# EAGLE design BenchPower (EAGLE 7.4.0)
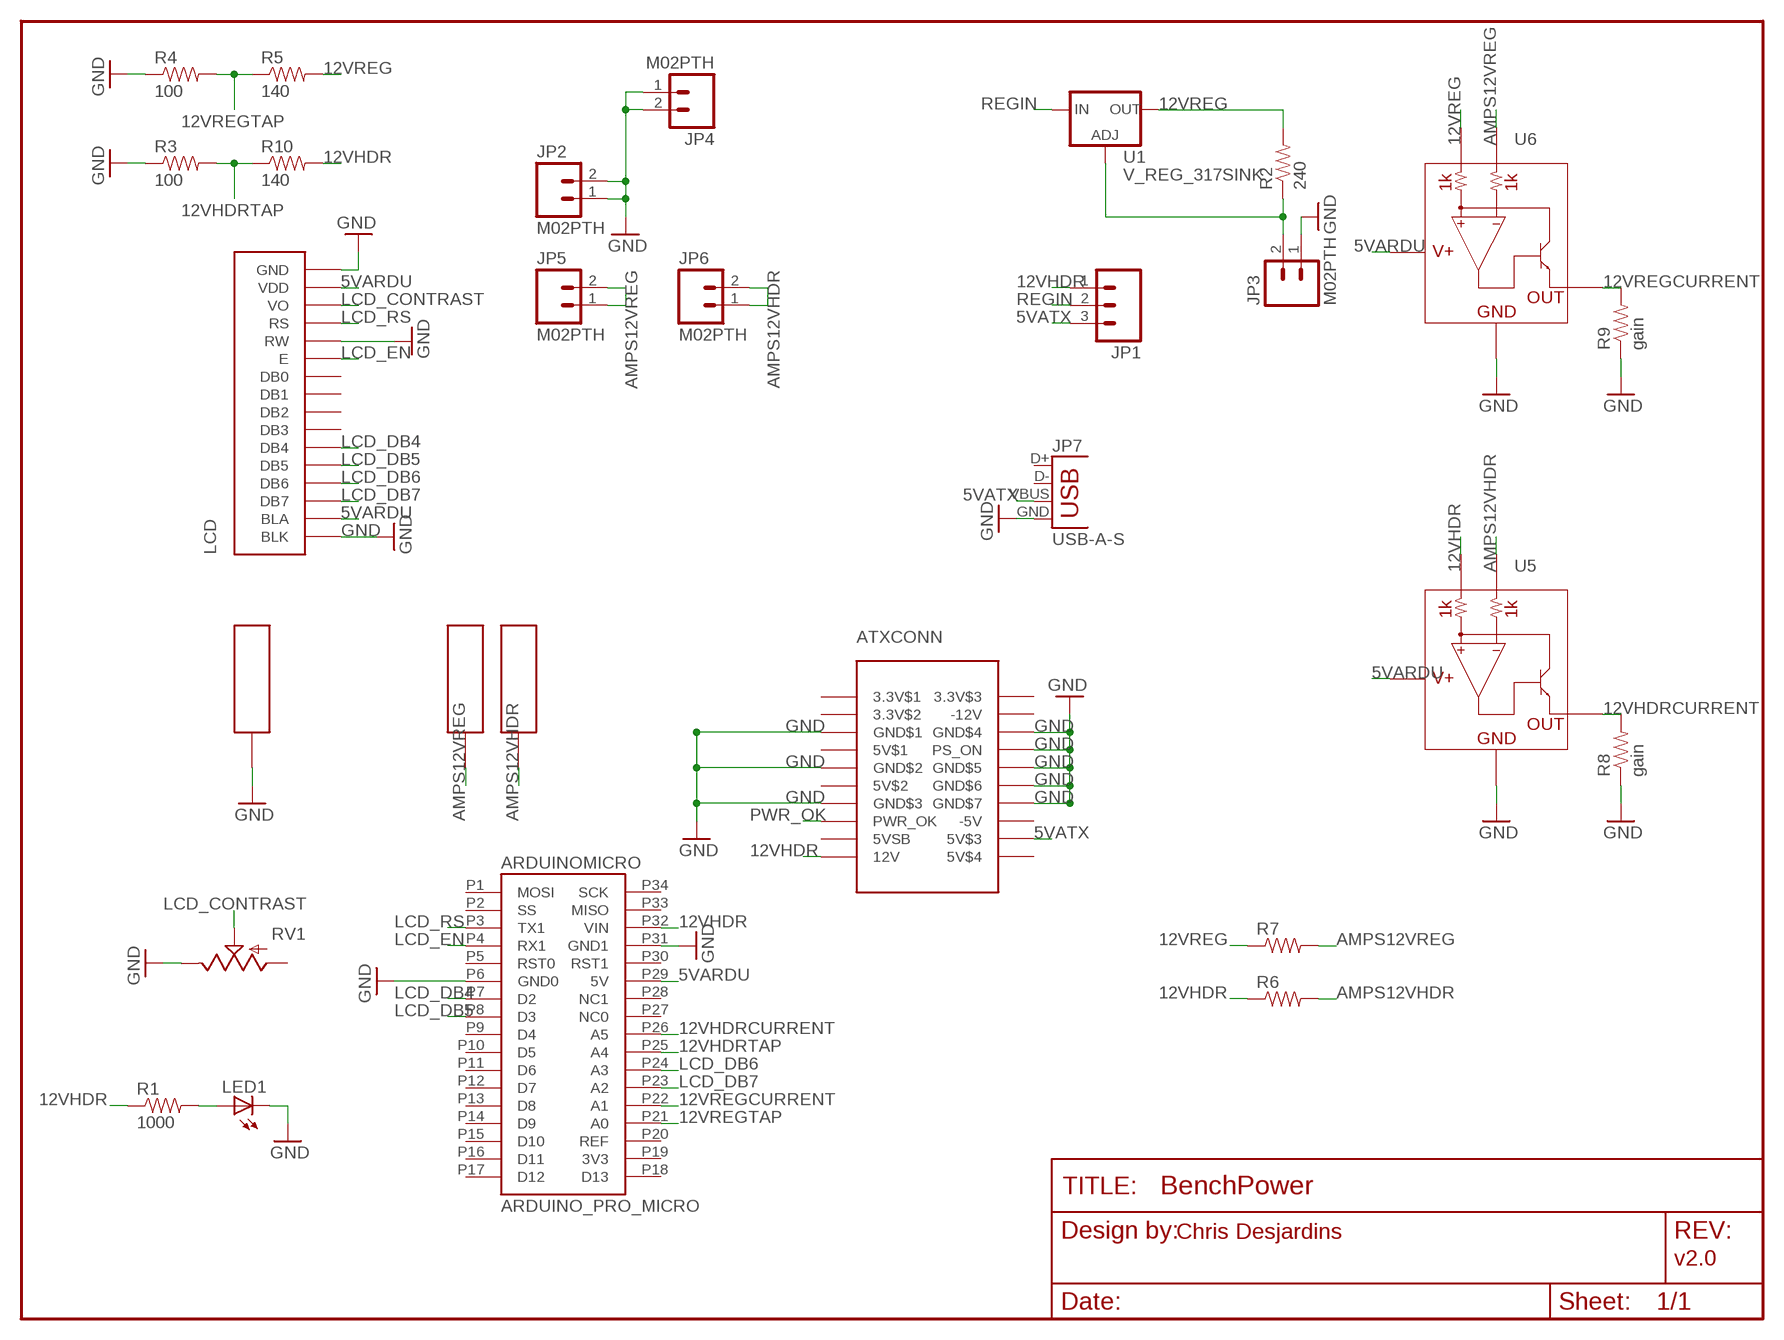
[diagram p0: schematic, sheet 1]

## Parts
ARDUINOMICRO  ARDUINO_PRO_MICRO  [ARDUINO_PRO_MICRO]
ATXCONN  ATXPOWER  [ATXPOWER]
JP1  M03PTH  [1X03]
JP2  M02PTH  [1X02]
JP3  M02PTH  [1X02]
JP4  M02PTH  [1X02]
JP5  M02PTH  [1X02]
JP6  M02PTH  [1X02]
JP7  USB-A-S  [USB-A-S]
LCD  16X2LCDDT162C  [DT162C]
LED1  LED3MM  [LED3MM]
PWR1  BINDINGPOST  [BINDINGPOST]
PWR2  BINDINGPOST  [BINDINGPOST]
R1  1000  RESISTORAXIAL-0.3  [AXIAL-0.3]
R2  240  RESISTORAXIAL-0.3  [AXIAL-0.3]
R3  100  RESISTORAXIAL-0.3  [AXIAL-0.3]
R4  100  RESISTORAXIAL-0.3  [AXIAL-0.3]
R5  140  RESISTORAXIAL-0.3  [AXIAL-0.3]
R6  RESISTOR1206  [1206]
R7  RESISTOR1206  [1206]
R8  gain  RESISTORAXIAL-0.3  [AXIAL-0.3]
R9  gain  RESISTORAXIAL-0.3  [AXIAL-0.3]
R10  140  RESISTORAXIAL-0.3  [AXIAL-0.3]
RV1  POT3266  [3266W]
U1  V_REG_317SINK  [TO220-ADJ]
U5  INA139  [SOT23-5]
U6  INA139  [SOT23-5]
U$5  BINDINGPOST  [BINDINGPOST]

## Nets
5VARDU: ARDUINOMICRO.P29(5V) LCD.P$2(VDD) LCD.P$15(BLA) U5.5(V+) U6.5(V+)
5VATX: ATXCONN.P$19(5V$3) JP1.3 JP7.VBUS
12VHDR: ARDUINOMICRO.P32(VIN) ATXCONN.P$10(12V) JP1.1 R1.P$1 R6.1 R10.P$2 U5.3(VIN+)
12VHDRCURRENT: ARDUINOMICRO.P26(A5) R8.P$2 U5.1(OUT)
12VHDRTAP: ARDUINOMICRO.P25(A4) R3.P$2 R10.P$1
12VREG: R2.P$2 R5.P$2 R7.1 U1.OUT U6.3(VIN+)
12VREGCURRENT: ARDUINOMICRO.P22(A1) R9.P$2 U6.1(OUT)
12VREGTAP: ARDUINOMICRO.P21(A0) R4.P$2 R5.P$1
ADJREG1: JP3.2 R2.P$1 U1.ADJ
AMPS12VHDR: JP6.1 JP6.2 PWR2.P$1 R6.2 U5.4(VIN-)
AMPS12VREG: JP5.1 JP5.2 PWR1.P$1 R7.2 U6.4(VIN-)
GND: ARDUINOMICRO.P6(GND0) ARDUINOMICRO.P31(GND1) ATXCONN.P$3(GND$1) ATXCONN.P$5(GND$2) ATXCONN.P$7(GND$3) ATXCONN.P$13(GND$4) ATXCONN.P$14(PS_ON) ATXCONN.P$15(GND$5) ATXCONN.P$16(GND$6) ATXCONN.P$17(GND$7) JP2.1 JP2.2 JP3.1 JP4.1 JP4.2 JP7.GND LCD.P$1(GND) LCD.P$5(RW) LCD.P$16(BLK) LED1.K(C) R3.P$1 R4.P$1 R8.P$1 R9.P$1 RV1.P$1(E) U5.2(GND) U6.2(GND) U$5.P$1
LCD_CONTRAST: LCD.P$3(VO) RV1.P$2(S)
LCD_DB4: ARDUINOMICRO.P7(D2) LCD.P$11(DB4)
LCD_DB5: ARDUINOMICRO.P8(D3) LCD.P$12(DB5)
LCD_DB6: ARDUINOMICRO.P24(A3) LCD.P$13(DB6)
LCD_DB7: ARDUINOMICRO.P23(A2) LCD.P$14(DB7)
LCD_EN: ARDUINOMICRO.P4(RX1) LCD.P$6(E)
LCD_RS: ARDUINOMICRO.P3(TX1) LCD.P$4(RS)
N$1: LED1.A R1.P$2
PWR_OK: ATXCONN.P$8(PWR_OK)
REGIN: JP1.2 U1.IN
Unconnected: ARDUINOMICRO.P1(MOSI) ARDUINOMICRO.P2(SS) ARDUINOMICRO.P5(RST0) ARDUINOMICRO.P9(D4) ARDUINOMICRO.P10(D5) ARDUINOMICRO.P11(D6) ARDUINOMICRO.P12(D7) ARDUINOMICRO.P13(D8) ARDUINOMICRO.P14(D9) ARDUINOMICRO.P15(D10) ARDUINOMICRO.P16(D11) ARDUINOMICRO.P17(D12) ARDUINOMICRO.P18(D13) ARDUINOMICRO.P27(NC0) ARDUINOMICRO.P28(NC1) ARDUINOMICRO.P30(RST1) ARDUINOMICRO.P33(MISO) ARDUINOMICRO.P34(SCK) JP7.D+ JP7.D- LCD.P$7(DB0) LCD.P$8(DB1) LCD.P$9(DB2) LCD.P$10(DB3) RV1.P$3(A)

## Notes on the sheet
- Chris Desjardins
- v2.0

## Power pins joined to a net without a drawn wire
3.3V$1: ATXCONN.P$1(3.3V$1)
3.3V$2: ATXCONN.P$2(3.3V$2)
3.3V$3: ATXCONN.P$11(3.3V$3)
3V3: ARDUINOMICRO.P19(3V3)
5V$1: ATXCONN.P$4(5V$1)
5V$2: ATXCONN.P$6(5V$2)
5V$4: ATXCONN.P$20(5V$4)
5VSB: ATXCONN.P$9(5VSB)
-5V: ATXCONN.P$18(-5V)
-12V: ATXCONN.P$12(-12V)
REF: ARDUINOMICRO.P20(REF)

## Library data of the parts
ARDUINOMICRO = ChrisD:ARDUINO_PRO_MICRO
ATXCONN = desjardins:ATXPOWER
JP1 = SparkFun-Connectors:M03: Header 3 Standard 3-pin 0.1" header. Use with straight break away headers (SKU : PRT-00116), right angle break away headers (PRT-00553), swiss pins (PRT-00743), machine pins (PRT-00117), and female headers (PRT-00115). Molex polarized connector foot print use with SKU : PRT-08232 with associated crimp pins and housings.
JP2-JP6 = SparkFun-Connectors:M02: Standard 2-pin 0.1" header. Use with - straight break away headers ( PRT-00116) - right angle break away headers (PRT-00553) - swiss pins (PRT-00743) - machine pins (PRT-00117) - female headers (PRT-00115) Molex polarized connector foot print use with: PRT-08233 with associated crimp pins and housings. 2.54_SCREWTERM for use with PRT-10571. 3.5mm Screw Terminal footprints for PRT-08084 5mm Screw Terminal footprints for use with PRT-08433
JP7 = SparkFun-Connectors:USB: USB Connectors USB-B-PTH is fully proven SKU : PRT-00139/CONN-08278 USB-miniB is fully proven SKU : PRT-00587 USB-A-PCB is untested. USB-A-H is throughly reviewed, but untested. Spark Fun Electronics SKU : PRT-00437 USB-B-SMT is throughly reviewed, but untested. Needs silkscreen touching up. USB-A-S has not been used/tested USB-MB-H has not been used/tested USB-MICROB has been used. CONN-09505
LCD = desjardins:16X2LCD
LED1 = adafruit:LED: LED OSRAM: - CHIPLED LG R971, LG N971, LY N971, LG Q971, LY Q971, LO R971, LY R971 LH N974, LH R974 LS Q976, LO Q976, LY Q976 LO Q996 - Hyper CHIPLED LW Q18S LB Q993, LB Q99A, LB R99A - SideLED LS A670, LO A670, LY A670, LG A670, LP A670 LB A673, LV A673, LT A673, LW A673 LH A674 LY A675 LS A676, LA A676, LO A676, LY A676, LW A676 LS A679, LY A679, LG A679 - Hyper Micro SIDELED® LS Y876, LA Y876, LO Y876, LY Y876 LT Y87S - SmartLED LW L88C, LW L88S LB L89C, LB L89S, LG L890 LS L89K, LO L89K, LY L89K LS L896, LA L896, LO L896, LY L896 - TOPLED LS T670, LO T670, LY T670, LG T670, LP T670 LSG T670, LSP T670, LSY T670, LOP T670, LYG T670 LG T671, LOG T671, LSG T671 LB T673, LV T673, LT T673, LW T673 LH T674 LS T676, LA T676, LO T676, LY T676, LB T676, LH T676, LSB T676, LW T676 LB T67C, LV T67C, LT T67C, LS T67K, LO T67K, LY T67K, LW E67C LS E67B, LA E67B, LO E67B, LY E67B, LB E67C, LV E67C, LT E67C LW T67C LS T679, LY T679, LG T679 LS T770, LO T770, LY T770, LG T770, LP T770 LB T773, LV T773, LT T773, LW T773 LH T774 LS E675, LA E675, LY E675, LS T675 LS T776, LA T776, LO T776, LY T776, LB T776 LHGB T686 LT T68C, LB T68C - Hyper Mini TOPLED® LB M676 - Mini TOPLED Santana® LG M470 LS M47K, LO M47K, LY M47K Source: http://www.osram.convergy.de/
PWR1 PWR2 U$5 = desjardins:BINDINGPOST
R1-R5 R8-R10 = SparkFun-Passives:RESISTOR: Resistor Basic schematic elements and footprints for 0603, 1206, and PTH resistors.
R6 R7 = SparkFun-Resistors:RESISTOR: Resistor Basic schematic elements and footprints for 0603, 1206, and PTH resistors.
RV1 = desjardins:POT
U1 = SparkFun-PowerIC:V_REG_317: Voltage Regulator Standard LM317 adjustable voltage regulator. AOI (Adjust Output Input). Google 'LM317 Calculator' for easy to use app to get the two resistor values needed. 240/720 for 5V output. 240/390 for 3.3V output. Spark Fun Electronics SKU : COM-00527
U5 U6 = SparkFun-AnalogIC:INA139: High-side shunt current sense 2.7V-40V, 1%

## Board
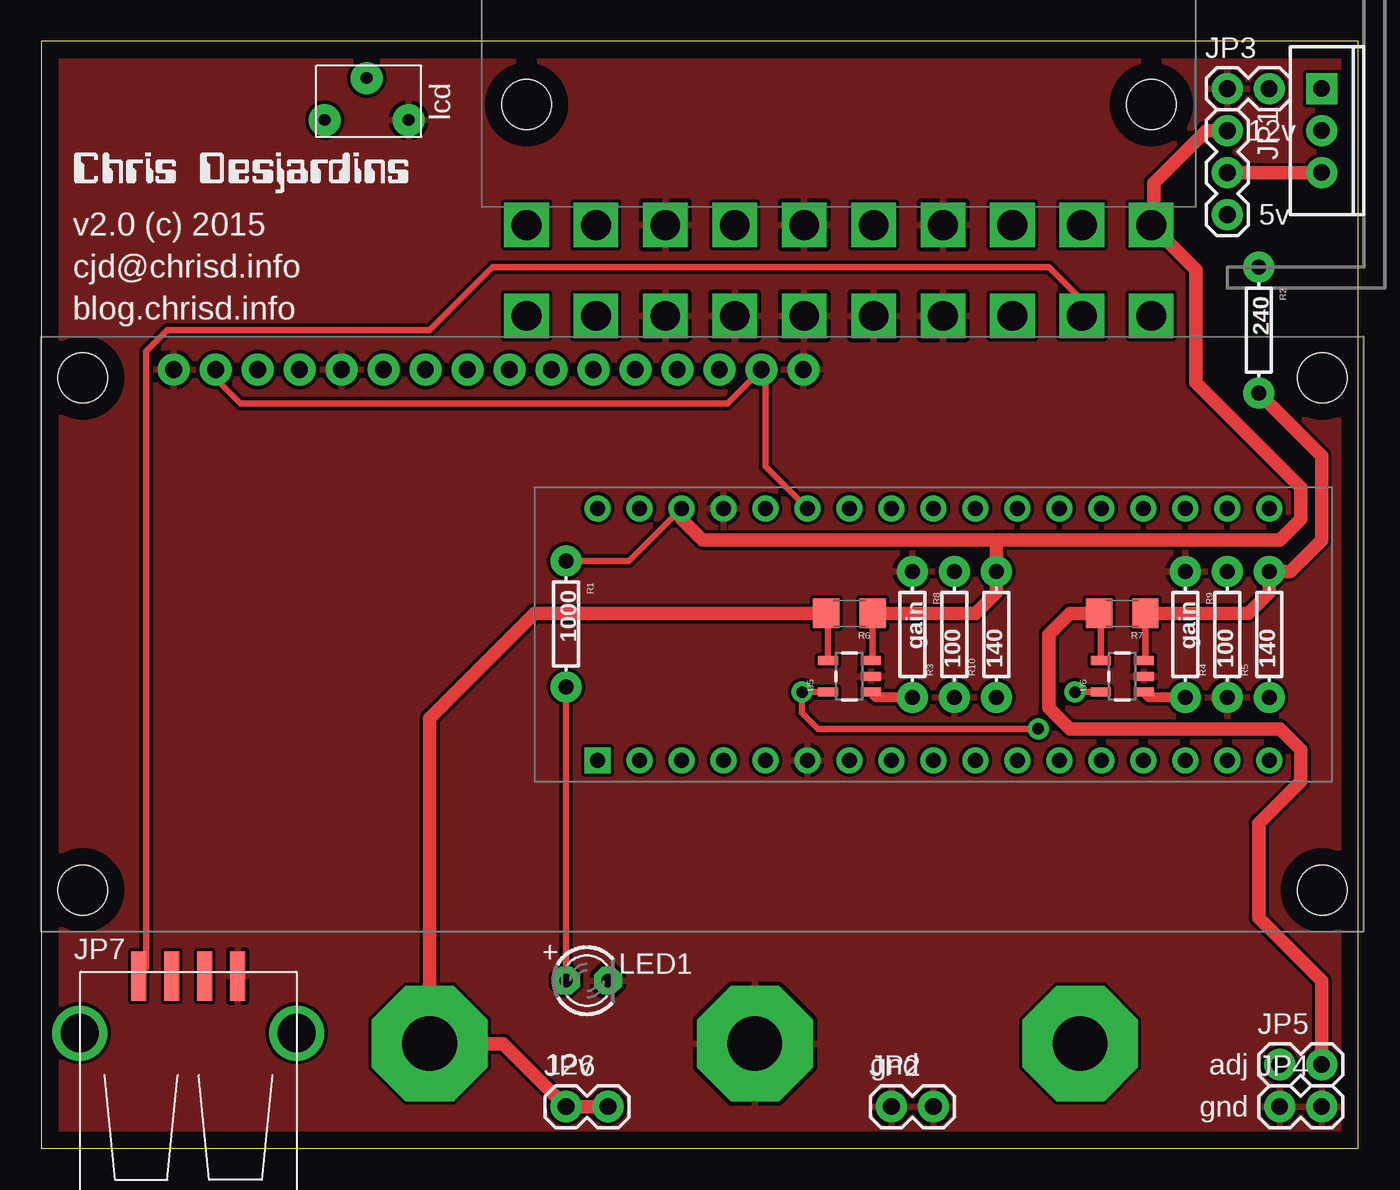
[diagram p1: board, top side]
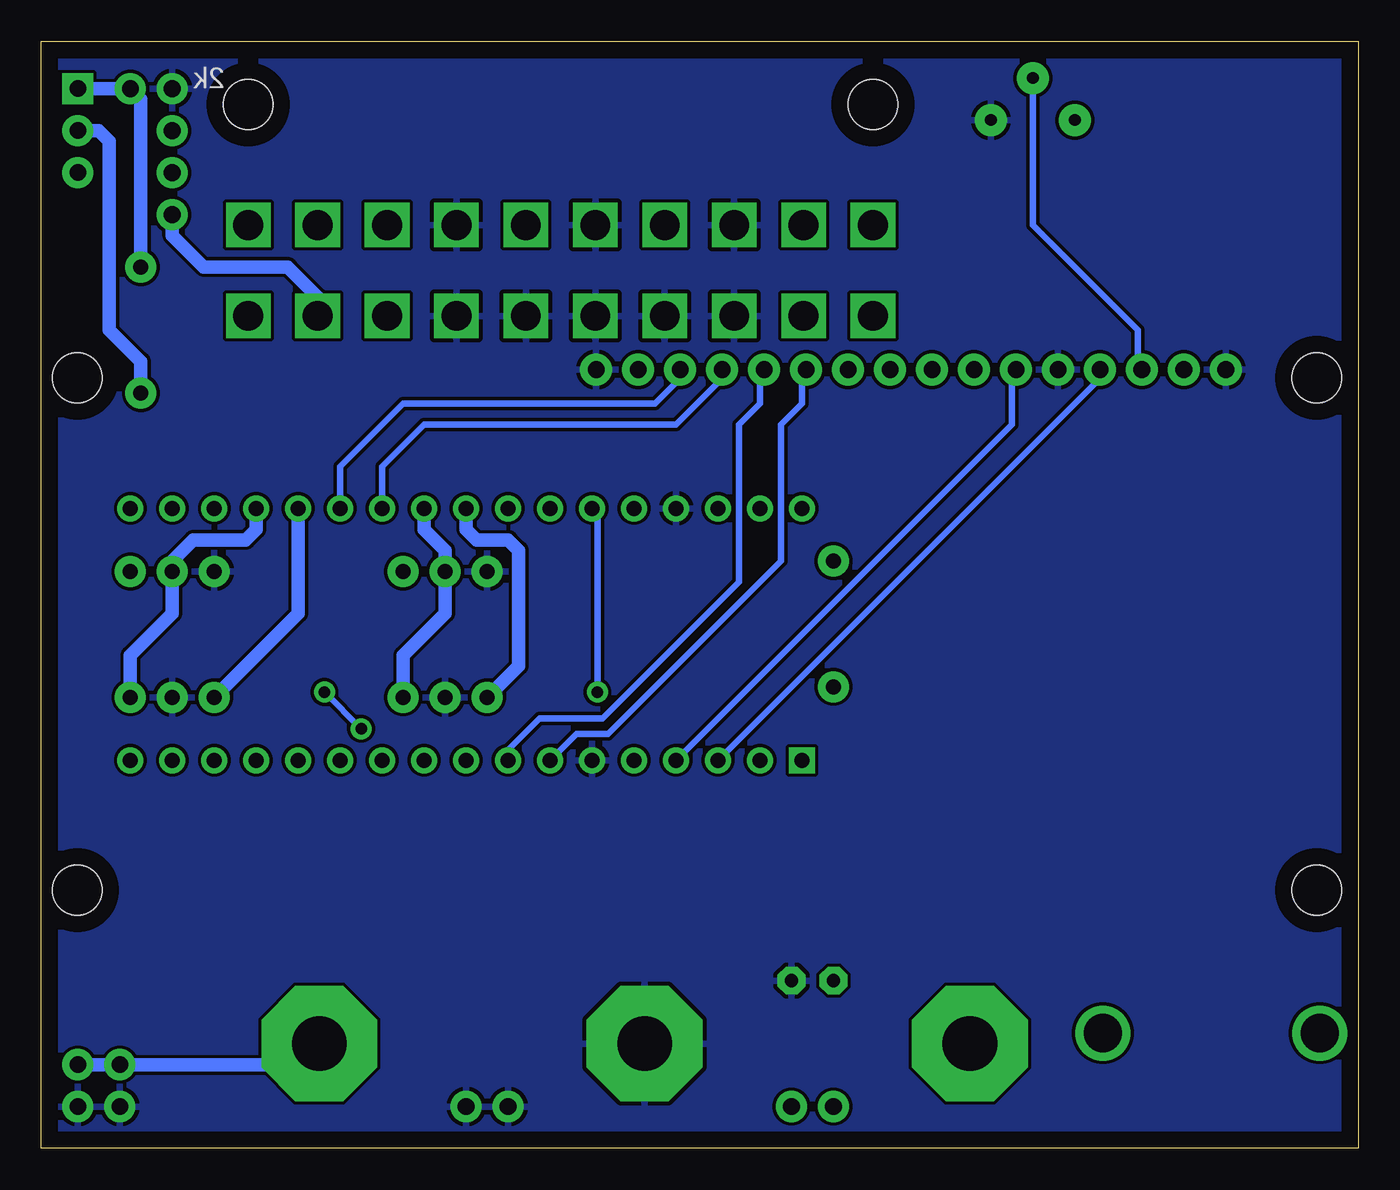
[diagram p2: board, bottom side, seen from below]

Size 79.68 x 67 mm. Coordinates in mm from the lower left corner, seen from the top.
Outline: 0,0 79.68,0 79.68,67 0,67 0,0
Copper layers (1*16): Top 0.035mm / dielectric 1.5mm / Bottom 0.035mm
Design rules "default": minimum track width 10mil, minimum drill 24mil, track to track 8mil, track to pad 8mil, pad to pad 8mil, via to via 8mil, smd to smd 8mil, copper to edge 40mil, drill to drill 8mil, minimum pad ring 10mil, minimum via ring 8mil, stop-mask expansion 4mil, vias tented up to drill 0mil, thermal gap 10mil

### Footprints (pad centres in the part's own frame; a part is rotated, then mirrored left to right if it is on the bottom)
ARDUINO_PRO_MICRO = drill 0.914 pad 1.575 square: P1 1.27,44.45 | drill 0.914 pad 1.575: P2 1.27,41.91; P3 1.27,39.37; P4 1.27,36.83; P5 1.27,34.29; P6 1.27,31.75; P7 1.27,29.21; P8 1.27,26.67; P9 1.27,24.13; P10 1.27,21.59; P11 1.27,19.05; P12 1.27,16.51; P13 1.27,13.97; P14 1.27,11.43; P15 1.27,8.89; P16 1.27,6.35; P17 1.27,3.81; P18 16.51,3.81; P19 16.51,6.35; P20 16.51,8.89; P21 16.51,11.43; P22 16.51,13.97; P23 16.51,16.51; P24 16.51,19.05; P25 16.51,21.59; P26 16.51,24.13; P27 16.51,26.67; P28 16.51,29.21; P29 16.51,31.75; P30 16.51,34.29; P31 16.51,36.83; P32 16.51,39.37; P33 16.51,41.91; P34 16.51,44.45
ATXPOWER = drill 1.8 square: P$1 0,-18.9; P$2 0,-14.7; P$3 0,-10.5; P$4 0,-6.3; P$5 0,-2.1; P$6 0,2.1; P$7 0,6.3; P$8 0,10.5; P$9 0,14.7; P$10 0,18.9; P$11 5.5,-18.9; P$12 5.5,-14.7; P$13 5.5,-10.5; P$14 5.5,-6.3; P$15 5.5,-2.1; P$16 5.5,2.1; P$17 5.5,6.3; P$18 5.5,10.5; P$19 5.5,14.7; P$20 5.5,18.9 | hole 3: -7.3,18.9; -7.3,-18.9
1X03 = drill 1.016 pad 1.88: 1 0,0; 2 2.54,0; 3 5.08,0
1X02 = drill 1.016 pad 1.88: 1 0,0; 2 2.54,0
USB-A-S = smd 3 x 0.9: D+ 3.45,-1; D- 3.45,1; GND 3.45,-3; VBUS 3.45,3 | drill 2.311: P$5 0,-6.566; P$6 0,6.566
DT162C = drill 1 pad 1.93: P$1 -32,16; P$2 -29.46,16; P$3 -26.92,16; P$4 -24.38,16; P$5 -21.84,16; P$6 -19.3,16; P$7 -16.76,16; P$8 -14.22,16; P$9 -11.68,16; P$10 -9.14,16; P$11 -6.6,16; P$12 -4.06,16; P$13 -1.52,16; P$14 1.02,16; P$15 3.56,16; P$16 6.1,16 | hole 3: -37.5,-15.5; -37.5,15.5; 37.5,-15.5; 37.5,15.5
LED3MM = drill 0.813 pad 1.676 octagon: A -1.27,0; K 1.27,0
BINDINGPOST = drill 3.3 pad 7 octagon: P$1 0,0
AXIAL-0.3 = drill 0.9 pad 1.88: P$1 -3.81,0; P$2 3.81,0
1206 = smd 1.6 x 1.8: 1 -1.4,0; 2 1.4,0
3266W = drill 0.7 pad 1.93: P$1 0,0; P$2 2.54,-2.54; P$3 5.08,0
TO220-ADJ = drill 1 pad 1.88 square: ADJ -2.54,0 | drill 1 pad 1.88: IN 2.54,0; OUT 0,0
SOT23-5 = smd 0.55 x 1.2: 1 -0.95,-1.3; 2 0,-1.3; 3 0.95,-1.3; 4 0.95,1.3; 5 -0.95,1.3

### Placement (x,y rotation side)
ARDUINOMICRO  78.11,22.23 90 top
ATXCONN  48.26,55.88 270 top
JP1  71.75,61.59 270 top
JP2  51.44,2.54 0 top
JP3  71.75,64.14 0 top
JP4  74.93,2.54 0 top
JP5  74.93,5.08 0 top
JP6  31.75,2.54 0 top
JP7  8.89,6.99 90 top
LCD  40.01,31.14 0 top
LED1  33.02,10.16 0 top
PWR1  62.87,6.35 0 top
PWR2  23.5,6.35 0 top
R1  31.75,31.75 270 top
R2  73.66,49.53 270 top
R3  55.24,31.11 90 top
R4  71.75,31.11 90 top
R5  74.3,31.11 90 top
R6  48.9,32.38 180 top
R7  65.41,32.38 180 top
R8  52.7,31.11 270 top
R9  69.22,31.11 270 top
R10  57.78,31.11 90 top
RV1  22.23,62.23 180 top
U1  77.47,61.59 270 top
U5  48.9,28.57 90 top
U6  65.41,28.57 90 top
U$3  [LOGO]  1.91,58.42 0 top
U$5  43.18,6.35 0 top

### Tracks (layer width: path | path; a pad name or v marks a point on that pad's centre or on a via)
5VARDU  (via drill 0.7 pad 1.27)
  Top 0.406: LCD.P$2 10.55,46.6 12.06,45.09 41.52,45.09 LCD.P$15 43.81,46.89 43.81,41.27 ARDUINOMICRO.P29 | U6.5 v62.55,27.62 | v60.33,25.4 46.99,25.4 46.04,26.35 v46.04,27.62 U5.5
  Bottom 0.406: v62.55,27.62 v60.33,25.4 | v46.04,27.62 46.04,38.42 ARDUINOMICRO.P29
5VATX
  Top 0.406: 62.87,50.28 ATXCONN.P$19 62.87,50.48 62.87,51.44 60.96,53.34 27.3,53.34 23.5,49.53 7.62,49.53 6.35,48.26 6.35,10.89 JP7.VBUS 5.71,10.61
  Bottom 0.813: ATXCONN.P$19 62.87,50.48 62.87,51.44 64.77,53.34 69.85,53.34 71.75,55.24 JP1.3
12VHDR
  Top 0.406: R6.1 50.3,29.62 U5.3 | R1.P$1 35.56,35.56 ARDUINOMICRO.P32
  Top 0.813: 57.78,36.83 74.93,36.83 76.2,38.1 76.2,40.01 69.85,46.35 69.85,53.19 ATXCONN.P$10 67.31,56.03 67.31,58.42 70.48,61.59 JP1.1 | ARDUINOMICRO.P32 38.73,38.1 40.01,36.83 57.78,36.83 | R6.1 56.52,32.38 57.78,33.66 R10.P$2 57.78,36.83
12VHDRCURRENT
  Top 0.61: R8.P$2 50.52,27.3 U5.1
  Bottom 0.813: ARDUINOMICRO.P26 53.98,37.47 53.34,36.83 51.44,36.83 50.8,36.2 50.8,29.21 R8.P$2
12VHDRTAP
  Bottom 0.813: ARDUINOMICRO.P25 56.52,37.47 55.24,36.2 R3.P$2 55.24,32.38 57.78,29.84 R10.P$1
12VREG
  Top 0.406: R7.1 66.81,29.62 U6.3
  Top 0.813: R7.1 73.03,32.38 74.3,33.66 R5.P$2 75.56,34.92 77.47,36.83 77.47,41.91 R2.P$2
  Bottom 0.813: U1.OUT 76.2,61.59 75.56,60.96 75.56,49.53 73.66,47.62 R2.P$2
12VREGCURRENT
  Top 0.61: R9.P$2 67.03,27.3 U6.1
  Bottom 0.813: ARDUINOMICRO.P22 64.14,32.38 R9.P$2
12VREGTAP
  Bottom 0.813: ARDUINOMICRO.P21 66.67,37.47 67.31,36.83 70.48,36.83 71.75,35.56 R4.P$2 71.75,32.38 74.3,29.84 R5.P$1
ADJREG1
  Bottom 0.813: U1.ADJ JP3.2 73.66,63.5 R2.P$1
AMPS12VHDR
  Top 0.406: U5.4 47.59,31.65
  Top 0.61: 47.59,31.65 R6.2
  Top 0.813: R6.2 29.84,32.38 23.5,26.04 PWR2.P$1 27.94,6.35 JP6.1 JP6.2
AMPS12VREG
  Top 0.406: U6.4 64.11,32.28 R7.2
  Top 0.813: R7.2 62.23,32.38 60.96,31.11 60.96,26.67 62.23,25.4 74.93,25.4 76.2,24.13 76.2,22.23 73.66,19.68 73.66,13.97 77.47,10.16 JP5.2
  Bottom 0.813: JP5.2 JP5.1 64.14,5.08 PWR1.P$1
GND
  pour Bottom: 1,1 79,1 79,66 1,66
  pour Top: 1,1 79,1 79,66 1,66
LCD_CONTRAST
  Bottom 0.406: RV1.P$2 19.68,55.88 13.34,49.53 13.34,47.38 LCD.P$3
LCD_DB4
  Bottom 0.406: ARDUINOMICRO.P7 47.31,25.08 45.4,25.08 34.92,35.56 34.92,43.81 33.66,45.09 33.66,46.89 LCD.P$11
LCD_DB5
  Bottom 0.406: ARDUINOMICRO.P8 51.44,24.13 49.53,26.04 45.72,26.04 37.47,34.29 37.47,43.81 36.2,45.09 36.2,46.89 LCD.P$12
LCD_DB6
  Bottom 0.406: ARDUINOMICRO.P24 59.05,41.27 56.52,43.81 41.27,43.81 38.73,46.35 38.73,46.89 LCD.P$13
LCD_DB7
  Bottom 0.406: ARDUINOMICRO.P23 61.59,41.27 57.78,45.09 42.55,45.09 41.27,46.35 41.27,46.89 LCD.P$14
LCD_EN
  Bottom 0.406: LCD.P$6 20.95,46.89 20.95,43.81 ARDUINOMICRO.P4
LCD_RS
  Bottom 0.406: ARDUINOMICRO.P3 15.63,46.6 LCD.P$4
N$1
  Top 0.406: R1.P$2 LED1.A
REGIN
  Top 0.813: JP1.2 U1.IN

### Text on the board
tPlace: lcd | 12v | 5v | v2.0 (c) 2015 | cjd@chrisd.info | blog.chrisd.info | adj | 12v | gnd | gnd
bPlace: 2k